# EasyEDA schematic 涂鸦智能从机板（强电）_2021-03-09.json
TITLE: Sheet_1; REV: 1.0; Date: 2020-12-12; Sheet: 1/1; Drawn By: verysunshine; Company: Your Company
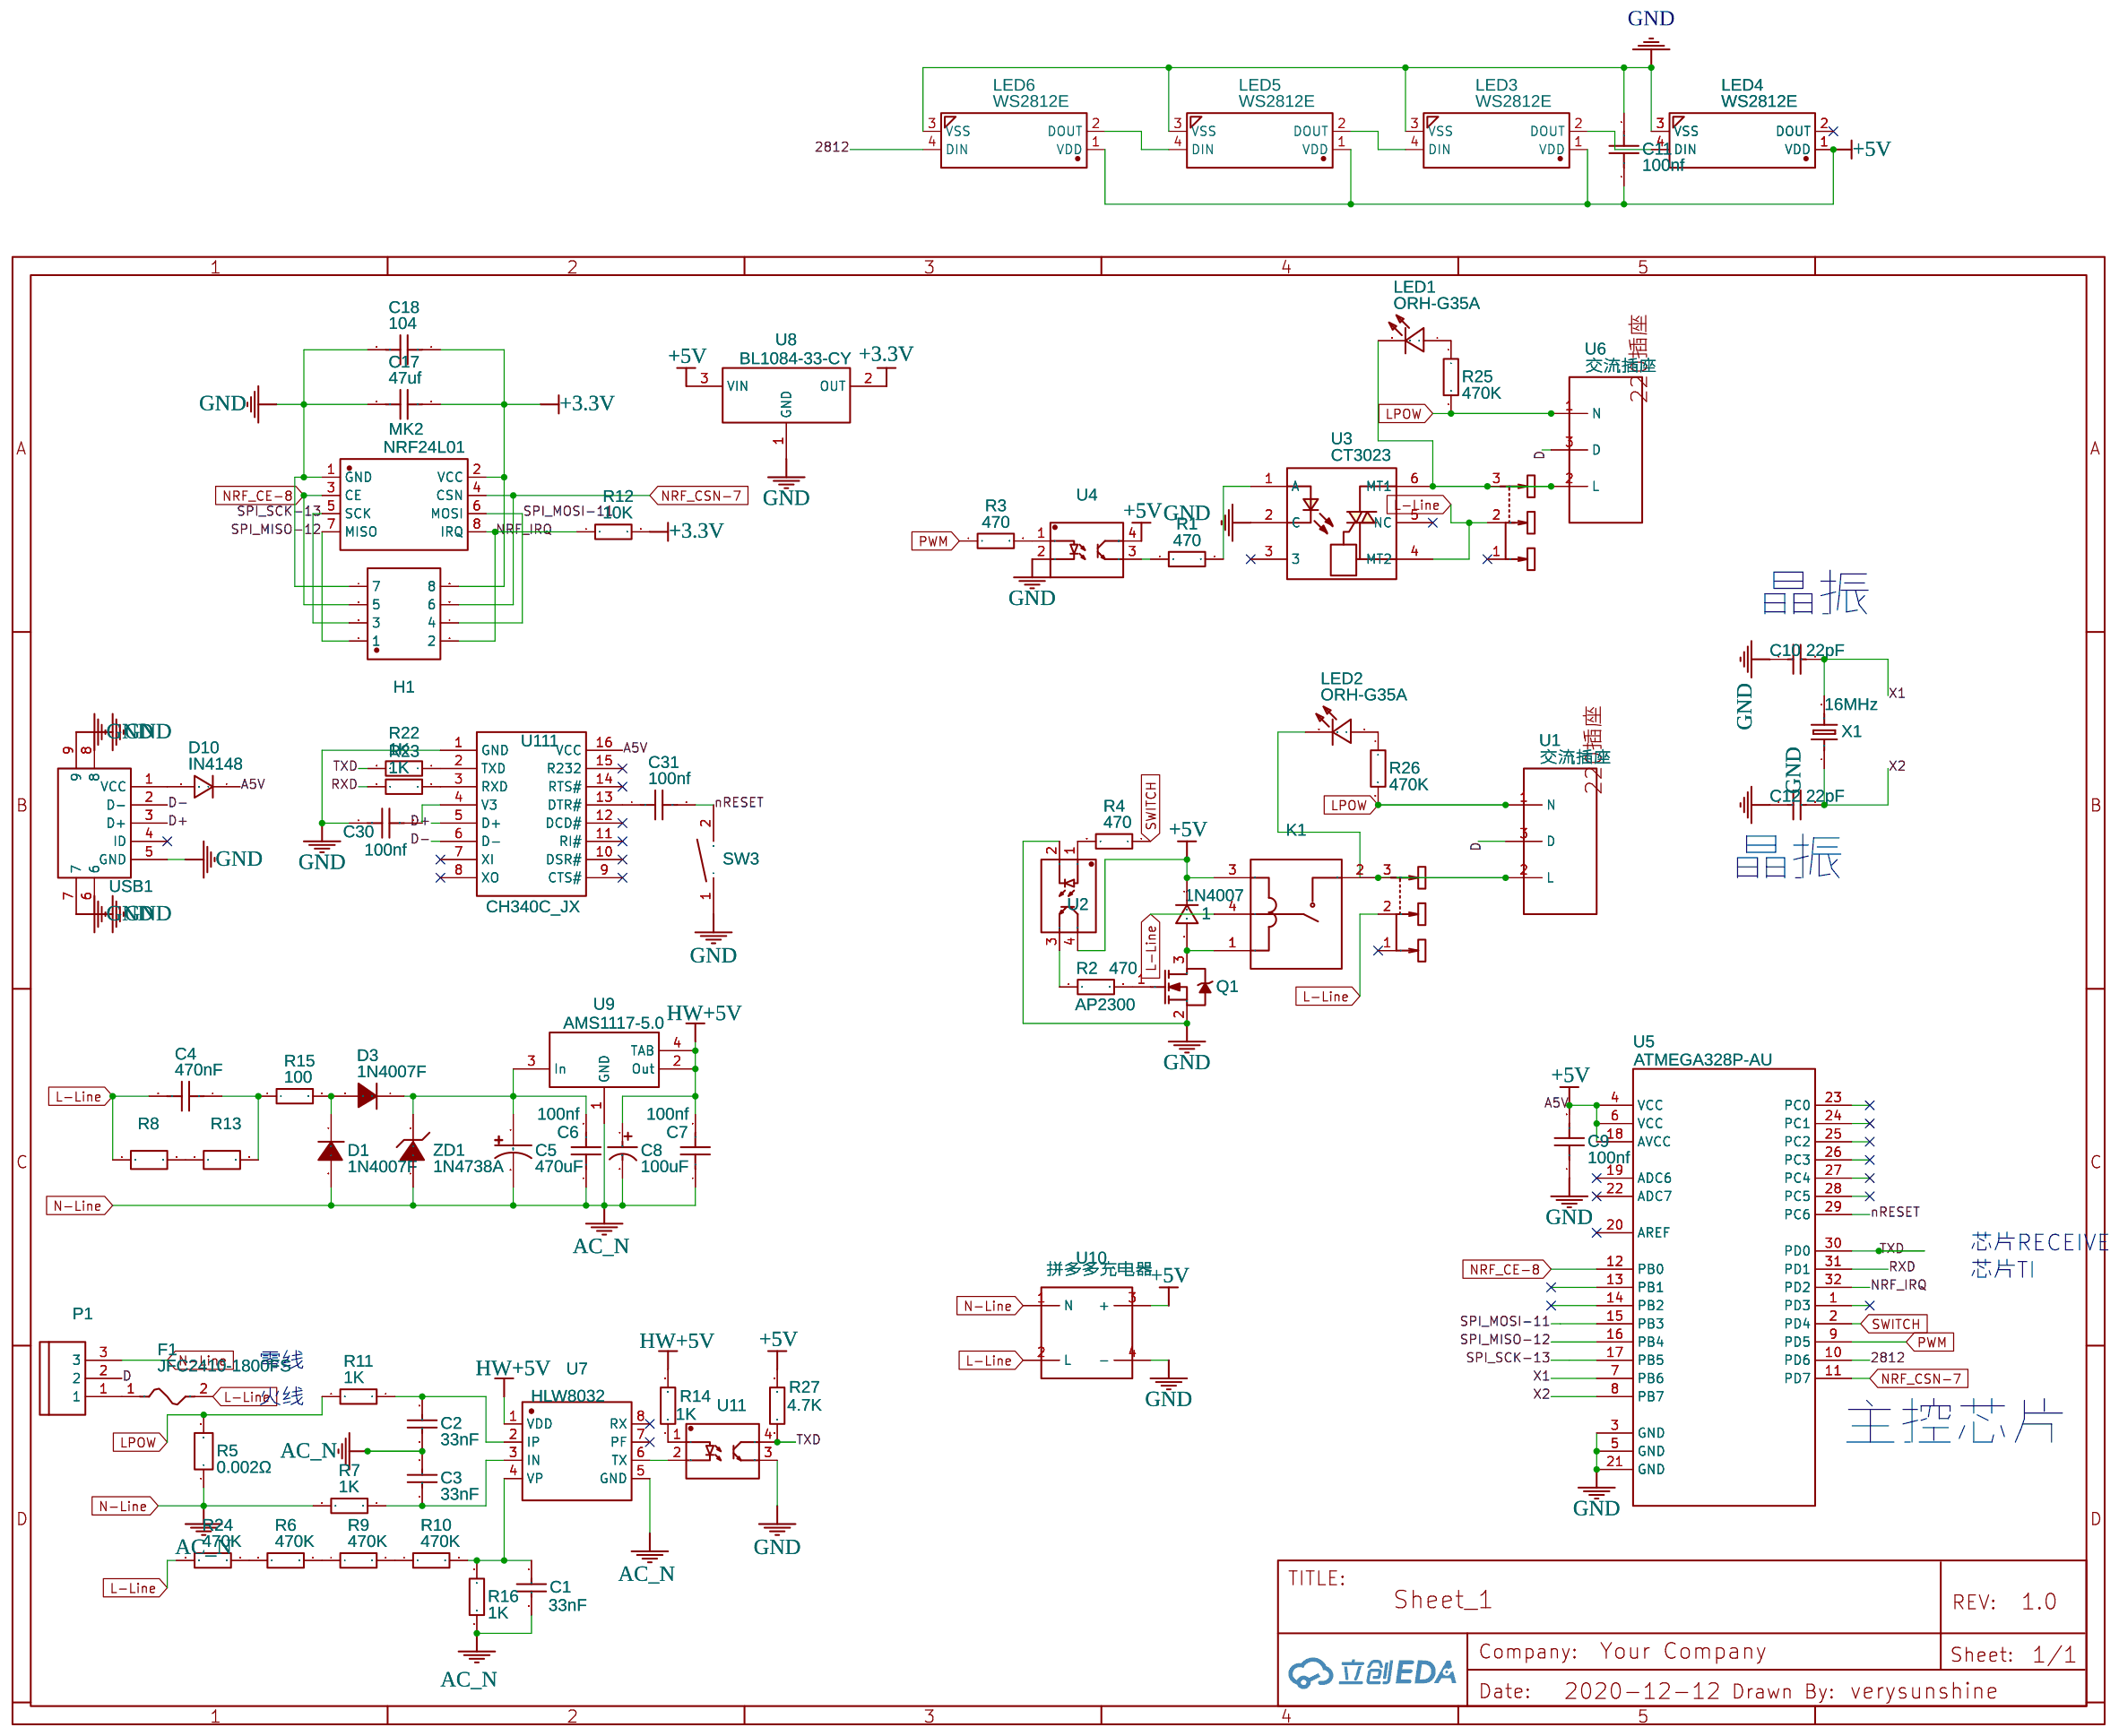
[diagram p0: schematic sheet]

## Parts
1  1N4007  [SMA_L4.4-W2.8-LS5.4-RD]
C1  33nF  [C0805]
C2  33nF  [C0805]
C3  33nF  [C0805]
C4  470nF  [CAP-TH_L22.5-W7.5-P20.00-D1.2]
C5  470uF  [CAP-TH_BD8.0-P3.50-D1.0-FD]
C6  100nf  [C0805]
C7  100nf  [C0805]
C8  100uF  [CAP-TH_BD5.0-P2.00-D0.8-FD]
C9  100nf  [C0805]
C10  22pF  [C0603]
C11  100nf  [C0805]
C12  22pF  [C0603]
C17  47uf  [C0805]
C18  104  [C0805]
C30  100nf  [C0805]
C31  100nf  [C0805]
D1  1N4007F  [SMAF_L3.5-W2.6-LS4.7-RD]
D3  1N4007F  [SMAF_L3.5-W2.6-LS4.7-RD]
D10  IN4148  [4148小封装]
F1  JFC2410-1800FS  [F2410]
H1  A2541HWR-2X4P  [HDR-TH_8P-P2.54-H-R2-C4-S2.54-W10.2]
K1  RD-105DM-A 10A  [RELAY-TH_RD-XXXXM]
LED1  ORH-G35A  [LED0805-R-RD]
LED2  ORH-G35A  [LED0805-R-RD]
LED3  WS2812E  [LED-SMD_4P-L5.0-W5.0-BR]
LED4  WS2812E  [LED-SMD_4P-L5.0-W5.0-BR]
LED5  WS2812E  [LED-SMD_4P-L5.0-W5.0-BR]
LED6  WS2812E  [LED-SMD_4P-L5.0-W5.0-BR]
MK2  NRF24L01  [WIRELM-NRF24L01]
P1  WJ500V-5.08-3P-14-00A  [CONN-TH_3P-P5.00_WJ500V-5.08-3P]
Q1  AP2300  [SOT-23-3_L3.0-W1.7-P0.95-LS2.9-BR]
R1  470  [R0805]
R2  470  [R0805]
R3  470  [R0805]
R4  470  [R0805]
R5  0.002Ω  [R3920]
R6  470K  [R0805]
R7  1K  [R0805]
R8  RT0805BRE07470KL  [R0805]
R9  470K  [R0805]
R10  470K  [R0805]
R11  1K  [R0805]
R12  10K  [R0805]
R13  RT0805BRE07470KL  [R0805]
R14  1K  [R0805]
R15  100  [RES-TH_BD4.5-L11.0-P15.00-D0.7]
R16  1K  [R0805]
R22  1K  [R0805]
R23  1K  [R0805]
R24  470K  [R0805]
R25  470K  [R0805]
R26  470K  [R0805]
R27  4.7K  [R0805]
SW2  SS-12D10L4  [SW-TH_SS-12D10L3]
SW3  TSA363G25-250B  [SW-SMD_L6.5-W3.6-LS8.0]
SW5  SS-12D10L4  [SW-TH_SS-12D10L3]
U1  交流插座  [电器插座]
U2  ORPC-817D  [DIP-4_L6.4-W4.6-P2.54-LS7.6-BL]
U3  CT3023  [DIP-6_L7.3-W6.5-P2.54-LS7.6-BL]
U4  ORPC-817D  [DIP-4_L6.4-W4.6-P2.54-LS7.6-BL]
U5  ATMEGA328P-AU  [TQFP-32_7X7X08P]
U6  交流插座  [电器插座]
U7  HLW8032  [SOP-8_L4.9-W3.9-P1.27-LS6.0-BL]
U8  BL1084-33-CY  [TO-252-2_L6.6-W6.1-P4.57-LS9.9-TL-CW]
U9  AMS1117-5.0  [SOT-223_L6.5-W3.5-P2.30-LS7.0-BR]
U10  拼多多充电器  [拼多多充电器]
U11  ORPC-817D  [DIP-4_L6.4-W4.6-P2.54-LS7.6-BL]
U111  CH340C_JX  [SOP16_150MIL_JX]
USB1  U253-051T-4BH87-S-2  [MICRO-USB-SMD_U253-051T-4BH87]
X1  16MHz  [HC-49US_L11.5-W4.5-P4.88]
ZD1  1N4738A  [DO-41_BD2.8-L4.2-P8.00-D0.7-FD]

## Library data of the parts
1 = 1N4007_C126233: Supplier: LCSC; Supplier Part: C126233; Manufacturer: SK; Contributor: LCSC; LCSC Assembly: Yes; SMT Type: Extend
C1-C3 = C2012C0G1H333JT000N: Supplier: LCSC; Manufacturer: TDK; Supplier Part: C76628
C4 = KP474J2J2001: Supplier: LCSC; Supplier Part: C390154; Manufacturer: KYET; Contributor: LCSC; JLCPCB SMD: Yes; SMT Type: Extend
C5 = LKFD11E471MF: Supplier: LCSC; Supplier Part: C270028; Manufacturer: Ymin; Contributor: LCSC
C6 C7 C9 C11 C30 C31 = C_0805_US: Contributor: LCEDA_Lib
C8 = 100uF 16V 5*7: Supplier: LCSC; Manufacturer: ValuePro; Supplier Part: C43803; JLCPCB SMD: Yes; SMT Type: Extend
C10 C12 = 0402CG220J500NT: Supplier: LCSC; Manufacturer: FH; LCSC Assembly: Yes; Supplier Part: C1555; SMT Type: Basic
C17 C18 = Cap_0603_US
D1 D3 = 1N4007F: Supplier: LCSC; Manufacturer: SK; Supplier Part: C110856; SMT Type: Extend; JLCPCB SMD: Yes
D10 = IN4148: Supplier: LCSC; Supplier Part: C14538; Manufacturer: Semtech; Contributor: LCSC
F1 = JFC2410-1800FS: Supplier: LCSC; Manufacturer: JDTFUSE; Contributor: LCSC; Supplier Part: C136373
H1 = A2541HWR-2X4P: Supplier: LCSC; Supplier Part: C239355; Manufacturer: Changjiang Connectors; Manufacturer Part: A2541HWR-2x4P; Contributor: LCSC; link: https://item.szlcsc.com/238459.html?ref=editor&logined=true; JLCPCB SMD: Yes; SMT Type: Extend
K1 = RD-105DM-A 10A: Supplier: LCSC; Supplier Part: C358582; Manufacturer: Wangrong; Contributor: LCSC; JLCPCB SMD: Yes; SMT Type: Extend
LED1 LED2 = ORH-G35A: Supplier: LCSC; Supplier Part: C205442; Manufacturer: Orient; Contributor: LCSC; SMT Type: Extend; JLCPCB SMD: Yes
LED3-LED6 = WS2812E: Supplier: LCSC; Supplier Part: C139127; Manufacturer: Worldsemi; Contributor: LCSC; SMT Type: Extend; JLCPCB SMD: Yes
MK2 = NRF24L01: Supplier: LCSC; Manufacturer: Ai-Thinker; Manufacturer Part: NRF24L01+功率加强版绑定2.4Gwireless module; Supplier Part: C90751
P1 = WJ500V-5.08-3P-14-00A: Supplier: LCSC; Manufacturer: ReliaPro; image: //image.lceda.cn/szlcsc/C72334.jpg; Supplier Part: C72334; JLCPCB SMD: Yes; SMT Type: Extend
Q1 = AP2300: Supplier: LCSC; Supplier Part: C360338; Manufacturer: ShenZhen Quan Li Semiconductor; Contributor: LCSC
R1-R4 = AC0805JR-07470RL: Supplier: LCSC; Supplier Part: C229215; Manufacturer: YAGEO; Contributor: LCSC
R5 = HOLRS3920-3W-2MR-1%: Supplier: LCSC; Supplier Part: C558629; Manufacturer: Milliohm; Manufacturer Part: HolRS3920-3W-2mR-1%; Contributor: LCSC
R6 R9 R10 R24-R26 = PTFR0805B470KN9: Supplier: LCSC; Supplier Part: C351564; Manufacturer: ResistorToday; Contributor: LCSC
R7 R11 R16 R22 R23 = AR05BTCW1001: Supplier: LCSC; Supplier Part: C316220; Manufacturer: Viking Tech; Contributor: LCSC
R8 R13 = RT0805BRE07470KL: Supplier: LCSC; Supplier Part: C706280; Manufacturer: YAGEO; Contributor: LCSC
R12 = TC0525B1002T5E: Supplier: LCSC; Manufacturer: UniOhm; Supplier Part: C55866; SMT Type: Extend; JLCPCB SMD: Yes
R14 = CR0805-FX-1001ELF: Supplier: LCSC; Supplier Part: C204136; Manufacturer: BOURNS; Contributor: LCSC
R15 = RWS02J1000A520NH: Supplier: LCSC; Supplier Part: C275067; Manufacturer: Futaba Elec; Contributor: LCSC; JLCPCB SMD: Yes; SMT Type: Extend
R27 = 0805W8F1001T5E: Supplier: LCSC; Manufacturer: UniOhm; LCSC Assembly: Yes; Supplier Part: C17513; SMT Type: Basic
SW2 SW5 = SS-12D10L4: Supplier: LCSC; Supplier Part: C843364; Manufacturer: XKB Connectivity; Contributor: LCSC
SW3 = TSA363G25-250B: Supplier: LCSC; Supplier Part: C354943; Manufacturer: BRIGHT; Contributor: LCSC
U1 U6 = 交流插座: Contributor: verysunshine
U2 U4 U11 = ORPC-817D: Supplier: LCSC; Supplier Part: C231231; Manufacturer: Orient; Contributor: LCSC
U3 = CT3023: Supplier: LCSC; Supplier Part: C127192; Manufacturer: CT Micro International; Contributor: LCSC
U5 = -: Supplier: LCSC; Manufacturer: MICROCHIP; image: //image.lceda.cn/szlcsc/C14877.jpg; Supplier Part: C14877; LCSC Assembly: Yes; SMT Type: Extend
U7 = HLW8032: Supplier: LCSC; Manufacturer: HILIWI; Supplier Part: C128023; SMT Type: Extend; JLCPCB SMD: Yes
U8 = BL1084-33-CY: Supplier: LCSC; Manufacturer: BL; Contributor: LCSC; Supplier Part: C167251; SMT Type: Extend; JLCPCB SMD: Yes
U9 = AMS1117-5.0: sourceId: HltLFyQwq; Supplier: LCSC; Manufacturer: AMS; image: //image.lceda.cn/szlcsc/C6187.jpg; Supplier Part: C6187; SMT Type: Basic; JLCPCB SMD: Yes
U10 = 拼多多充电器: Contributor: verysunshine
U111 = -: Supplier: LCSC
USB1 = U253-051T-4BH87-S-2: Supplier: LCSC; Supplier Part: C319173; Manufacturer: XKB Enterprise; Contributor: LCSC
X1 = XIHCELNANF-16MHZ: Supplier: LCSC; Supplier Part: C295075; Manufacturer: TAITIEN Elec; Contributor: LCSC; JLCPCB SMD: Yes; SMT Type: Extend
ZD1 = 1N4738A: Supplier: LCSC; Manufacturer: SEMTECH; image: //image.lceda.cn/szlcsc/C48508.jpg; Supplier Part: C48508; JLCPCB SMD: Yes; SMT Type: Extend

## Nets
+3.3V: C17.1 C18.1 H1.8 MK2.2(VCC) R12.2 U8.2(OUT)
+5V: 1.1 C9.2 C11.1 D10.1 K1.3 LED3.1(VDD) LED4.1(VDD) LED5.1(VDD) LED6.1(VDD) R27.2 U2.4(C) U4.4(C) U5.4(VCC) U5.6(VCC) U5.18(AVCC) U8.3(VIN) U10.3(+) U111.16(VCC)
GND: C9.1 C10.1 C11.2 C12.1 C17.2 C18.2 C30.1 H1.7 LED3.3(VSS) LED4.3(VSS) LED5.3(VSS) LED6.3(VSS) MK2.1(GND) Q1.2(S) SW3.1 U2.2(C) U3.2(C) U4.2(C) U5.3(GND) U5.5(GND) U5.21(GND) U8.1(GND) U10.4(-) U11.3(E) U111.1(GND) USB1.5(GND) USB1.6 USB1.7 USB1.8 USB1.9
2812: LED6.4(DIN) U5.10(PD6)
AC_N: C1.1 C2.1 C3.2 C5.2 C6.1 C7.1 C8.2 D1.2(A) P1.3 R5.1 R7.2 R16.1 U7.5(GND) U9.1(GND) U10.1(N) ZD1.1(A)
D: P1.2 U1.3(D) U6.3(D)
D+: U111.5(D+) USB1.3(D+)
D-: U111.6(D-) USB1.2(D-)
HW+5V: C7.2 C8.1 R14.2 U7.1(VDD) U9.2(Out) U9.4(TAB)
L-Line: C4.2 F1.2 K1.4 R8.1 R24.1 SW2.2 SW5.2 U3.4(MT2) U10.2(L)
LPOW: R5.2 R11.2 R25.2 R26.2 U1.1(N) U6.1(N)
nRESET: C31.2 SW3.2 U5.29(PC6)
NRF_CE-8: H1.5 MK2.3(CE) U5.12(PB0)
NRF_CSN-7: H1.6 MK2.4(CSN) U5.11(PD7)
NRF_IRQ: H1.2 MK2.8(IRQ) R12.1 U5.32(PD2)
PWM: R3.1 U5.9(PD5)
RXD: R23.2 U5.31(PD1)
SPI_MISO-12: H1.1 MK2.7(MISO) U5.16(PB4)
SPI_MOSI-11: H1.4 MK2.6(MOSI) U5.15(PB3)
SPI_SCK-13: H1.3 MK2.5(SCK) U5.17(PB5)
SWITCH: R4.1 U5.2(PD4)
TXD: R22.2 R27.1 U5.30(PD0) U11.4(C)
X1: C10.2 U5.7(PB6) X1.2
X2: C12.2 U5.8(PB7) X1.1
Net-(1-2): 1.2 K1.1 Q1.3(D)
Net-(C1-2): C1.2 R10.2 R16.2 U7.4(VP)
Net-(C2-2): C2.2 R11.1 U7.2(IP)
Net-(C3-1): C3.1 R7.1 U7.3(IN)
Net-(C4-1): C4.1 R13.2 R15.1
Net-(C5-1): C5.1 C6.2 D3.1(C) U9.3(In) ZD1.2(K)
Net-(C30-2): C30.2 U111.4(V3)
Net-(C31-1): C31.1 U111.13(DTR#)
Net-(D1-1): D1.1(C) D3.2(A) R15.2
Net-(D10-2): D10.2 USB1.1(VCC)
Net-(F1-1): F1.1 P1.1
Net-(K1-2): K1.2 LED2.2(C) SW2.3 U1.2(L)
Net-(LED1-1): LED1.1(A) R25.1
Net-(LED1-2): LED1.2(C) SW5.3 U3.6(MT1) U6.2(L)
Net-(LED2-1): LED2.1(A) R26.1
Net-(LED3-2): LED3.2(DOUT) LED4.4(DIN)
Net-(LED3-4): LED3.4(DIN) LED5.2(DOUT)
Net-(LED5-4): LED5.4(DIN) LED6.2(DOUT)
Net-(Q1-1): Q1.1(G) R2.2
Net-(R1-1): R1.1 U4.3(E)
Net-(R1-2): R1.2 U3.1(A)
Net-(R2-1): R2.1 U2.3(E)
Net-(R3-2): R3.2 U4.1(A)
Net-(R4-2): R4.2 U2.1(A)
Net-(R6-1): R6.1 R24.2
Net-(R6-2): R6.2 R9.1
Net-(R8-2): R8.2 R13.1
Net-(R9-2): R9.2 R10.1
Net-(R14-1): R14.1 U11.1(A)
Net-(R22-1): R22.1 U111.2(TXD)
Net-(R23-1): R23.1 U111.3(RXD)
Net-(U7-6): U7.6(TX) U11.2(C)

Not connected (* = marked no-connect by the designer): LED4 2(DOUT)*; SW2 1*; SW5 1*; U3 3* 5(NC)*; U5 1(PD3) 13(PB1) 14(PB2) 19(ADC6)* 20(AREF)* 22(ADC7)* 23(PC0) 24(PC1) 25(PC2) 26(PC3) 27(PC4) 28(PC5); U7 7(PF)* 8(RX)*; U111 7(XI)* 8(XO)* 9(CTS#)* 10(DSR#)* 11(RI#)* 12(DCD#)* 14(RTS#)* 15(R232)*; USB1 4(ID)*

## Notes on the sheet
- 晶振
- 晶振
- 芯片RECEIVE
- 芯片TI
- 零线
- 火线
- 主控芯片
